# EAGLE schematic pcb bobinadora (EAGLE 6.4)
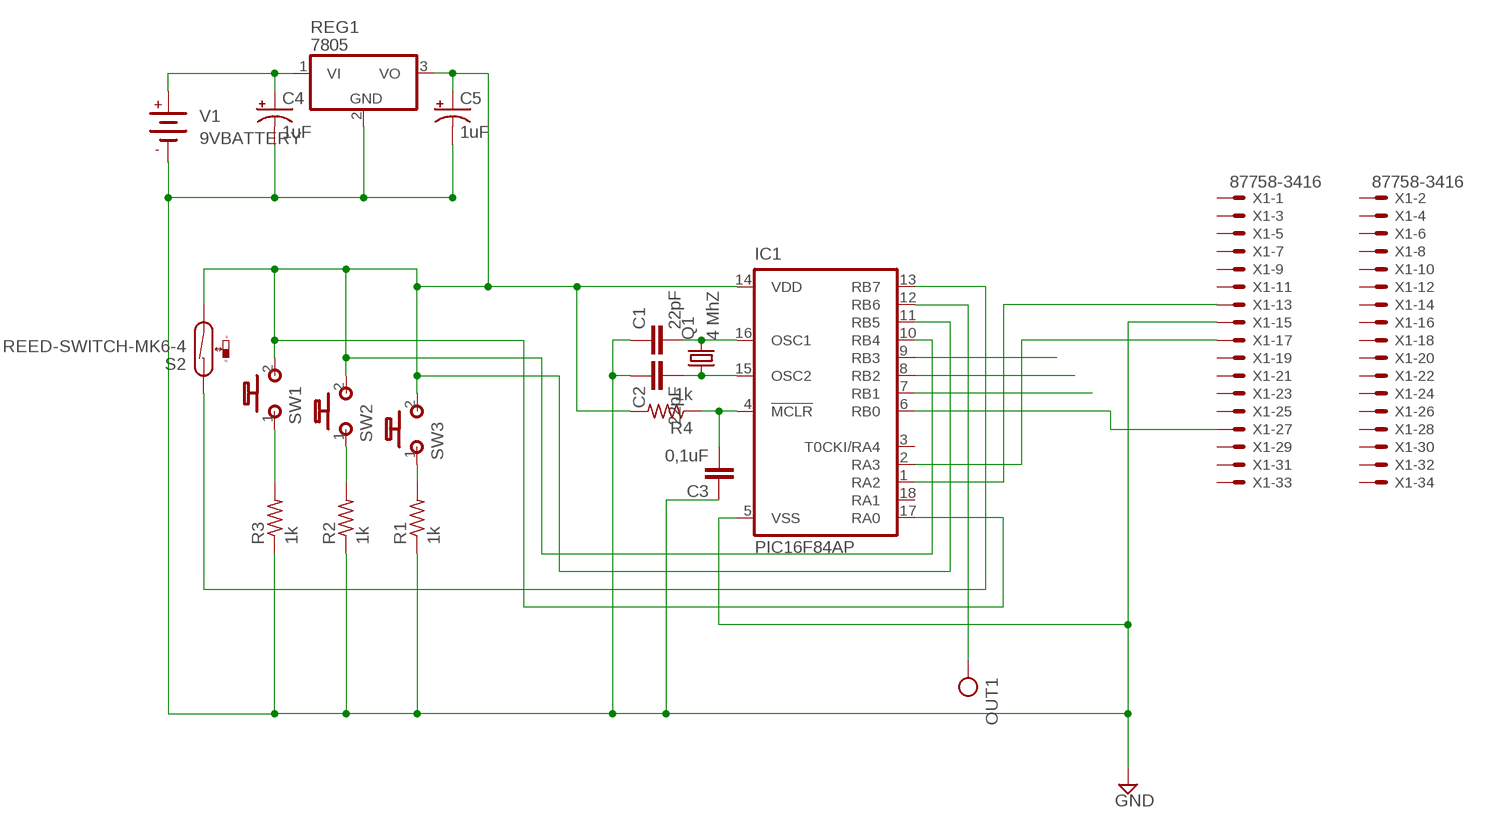
[diagram p0: schematic, sheet 1]

## Parts
C1  22pF  050X030_0251  [050X030_025]
C2  22pF  050X030_0251  [050X030_025]
C3  0,1uF  050X030_0251  [050X030_025]
C4  1uF  050  [050_020]
C5  1uF  050  [050_020]
IC1  PIC16F84AP  [DIL18]
OUT1  OUT(T)  [SQUARE]
Q1  4 MhZ  CRYSTALHC18U-V  [HC18U-V]
R1  1k  6MM.4  [R0207/4]
R2  1k  6MM.4  [R0207/4]
R3  1k  6MM.4  [R0207/4]
R4  1k  6MM.4  [R0207/4]
REG1  7805  [TO92-]
S2  REED-SWITCH-MK6-4  [MK6-4]
SW1  MOMENTARY  [SPST]
SW2  MOMENTARY  [SPST]
SW3  MOMENTARY  [SPST]
V1  9VBATTERY  [AB9V]
X1  87758-3416  [87758-3416]

## Nets
GND: C1.1 C2.1 C3.1 C4.- C5.- IC1.5(VSS) R1.1 R2.1 R3.1 REG1.2(GND) V1.- X1.15
N$1: R2.2 SW2.1(P)
N$2: R3.2 SW1.1(P)
N$4: R1.2 SW3.1(P)
N$5: IC1.6(RB0) X1.27
N$6: IC1.7(RB1)
N$7: IC1.8(RB2)
N$8: IC1.9(RB3)
N$9: IC1.1(RA2) X1.13
N$10: C1.2 IC1.16(OSC1) Q1.2
N$11: IC1.13(RB7) S2.1
N$12: C2.2 IC1.15(OSC2) Q1.1
N$14: C3.2 IC1.4(!MCLR) R4.1
N$18: C4.+ REG1.1(VI) V1.+
N$19: C5.+ IC1.10(RB4) IC1.11(RB5) IC1.14(VDD) IC1.17(RA0) R4.2 REG1.3(VO) S2.2 SW1.2(S) SW2.2(S) SW3.2(S)
N$20: IC1.2(RA3) X1.17
OUT: IC1.12(RB6) OUT1.1(OUT)
Unconnected: IC1.3(T0CKI/RA4) IC1.18(RA1) X1.1 X1.2 X1.3 X1.4 X1.5 X1.6 X1.7 X1.8 X1.9 X1.10 X1.11 X1.12 X1.14 X1.16 X1.18 X1.19 X1.20 X1.21 X1.22 X1.23 X1.24 X1.25 X1.26 X1.28 X1.29 X1.30 X1.31 X1.32 X1.33 X1.34

## Library data of the parts
C1-C3 = gm-caps-ceramic:050X030_025: 47 - 120pF Xicon Ceramic Disc 2.5mm lead spacing
C4 C5 = gm-caps-electro-pol:050: 0.22 - 100uF Xicon values at Mouser.com: 10V: 10 - 100uF; 16V: 2.2 - 47uF; 25V: 0.47 - 47uF; 50V: 0.22 - 22uF
IC1 = microchip:PIC16F8*: MICROCONTROLLER 8-Bit PIC16F8X Family - CMOS Flash/EEPROM Pin Compatible : PIC16F83, PIC16CR83, PIC16F84A, PIC16CR84 see also PIC16C* <DEVICE:PIC16C*>; MF: MICROCHIP; MPN: PIC16F84A-04I/P; OC_FARNELL: 9760865; OC_NEWARK: 69K7635
OUT1 = gm-supply:OUT(T): Output obsolete: use Pad instead and label net output label with circuit board terminal/pad usually appears only once on a schematic
Q1 = crystal:CRYSTAL: CRYSTAL; OC_FARNELL: unknown; OC_NEWARK: unknown
R1-R4 = gm-resistors:6MM: 6mm Resistors Leads spaced 1-6 holes apart for 0.1" perfboard. Suitable for 1/4 watt resistors.
REG1 = gm-regulators:7805
S2 = switch-reed:REED-SWITCH-: Reed Sensor; OC_FARNELL: unknown
SW1-SW3 = gm-switches:MOMENTARY
V1 = gm-supply:9VBATTERY
X1 = con-molex:87758-3416: 34 Pin - 2mm Dual Row Single Wafer, Vertical T/H HDR Source: http://www.molex.com/pdm_docs/sd/877580616_sd.pdf; MPN: 87758-3416; OC_FARNELL: unknown; OC_NEWARK: 25M5686